# Altium project Copy of MB1363.PrjPcb (part 1 of 2)
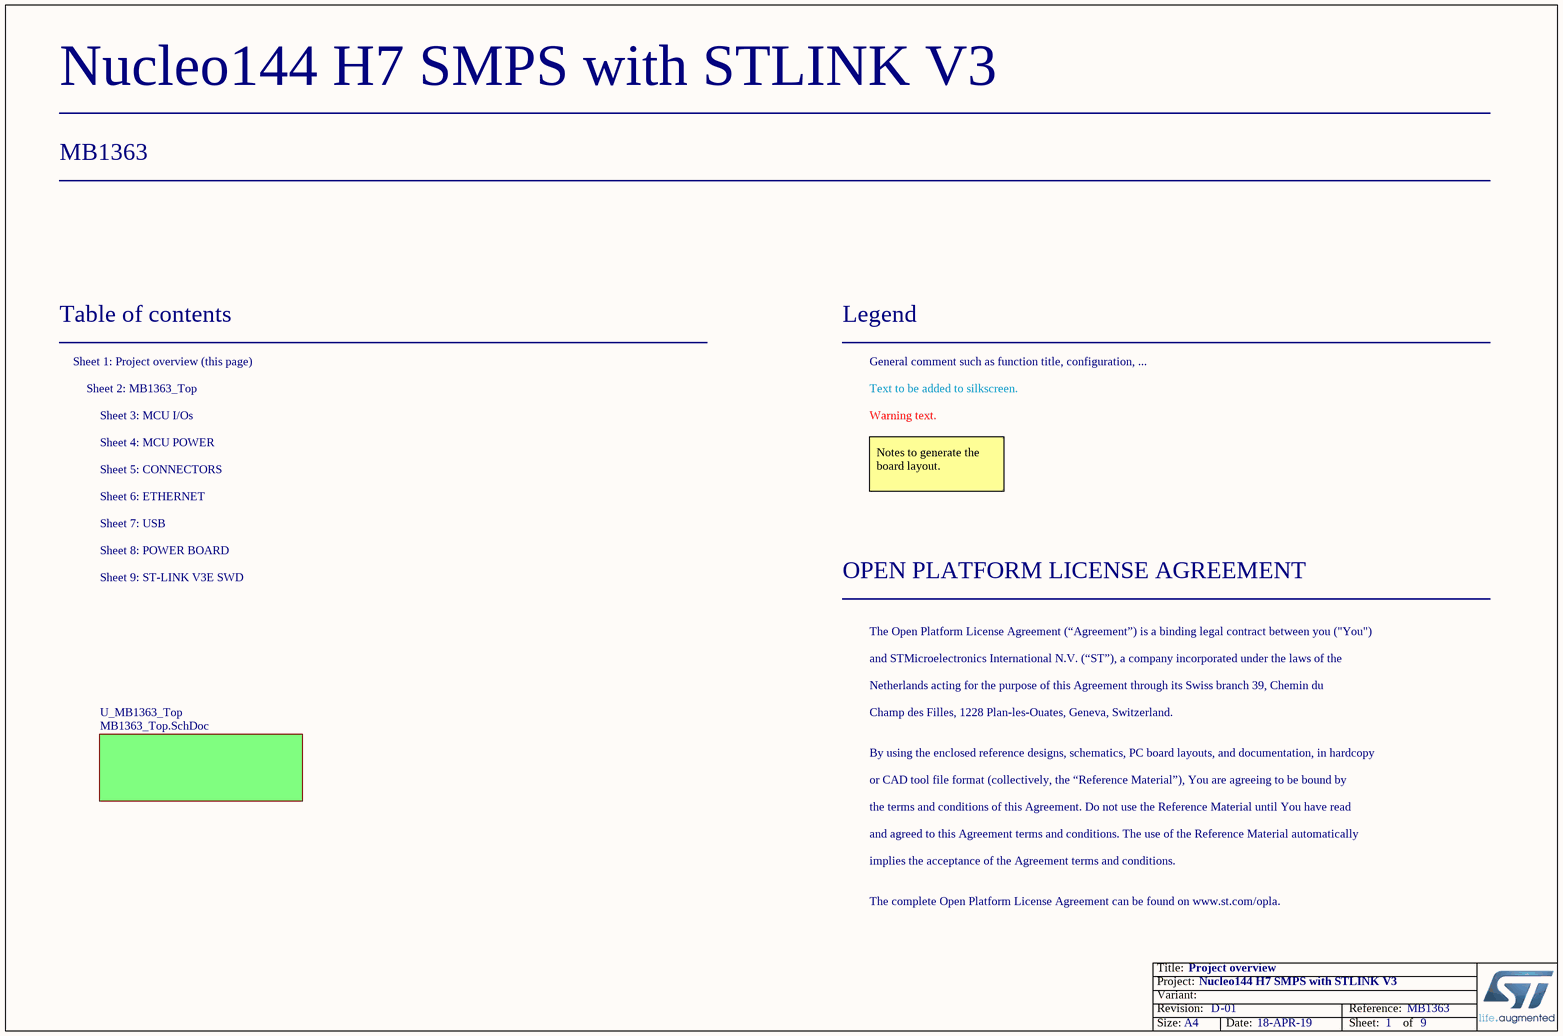
[diagram p0: Copy of Project_Overview.SchDoc]
Board_Assembly_Revision: 01; Board_Document_Date: 18-APR-19; Board_Name: Nucleo144 H7 SMPS with STLINK V3; Board_PCB_Revision: D; Board_Reference: MB1363
11 sheets, 237 parts. Net scope: hierarchical (ports join the sheet entries above them; power ports are global).
Board file: Copy of MB1363.PcbDoc
Sheets:
  Copy of Project_Overview.SchDoc
  Copy of mb1363_Top.SchDoc
    U_Connectors = Copy of Connectors.SchDoc
    U_Power_Board = Copy of Power_Board.SchDoc
    U_MCU_144_IOs = Copy of MCU_144_IOs.SchDoc
    U_MCU_144_POWER = Copy of MCU_144_POWER.SchDoc
    U_USB = USB.SchDoc
    U_Ethernet = Ethernet.SchDoc
    U_ST_LINK_V3E = Copy of ST_LINK_V3E.SchDoc
    U_CAN_TJA1050_Page1 = CAN_TJA1050_Page1.SchDoc
    U_12V_Regulator = 12V_Regulator.SchDoc

## Sheet Copy of Project_Overview.SchDoc: Project overview
size A4; Date: Not used; ApprovedBy: Not used; CheckedBy: Not used; Author: Not used; CompanyName: STMicroelectronics; DrawnBy: Not used; Engineer: Not used; Organization: Not used; Address1: Not used; Address2: Not used; Address3: Not used; Address4: Not used; DocumentNumber: 1; Revision: Not used; SheetNumber: 1; SheetTotal: 9; CurrentTime: Not used; CurrentDate: Not used; Time: Not used; DocumentFullPathAndName: Not used; DocumentName: Not used; ModifiedDate: Not used; ImagePath: Not used; ProjectName: Not used; Application_BuildNumber: Not used

### Sub-sheets
U_MB1363_Top = MB1363_Top.SchDoc (file not in this document): no entries

### Notes on the sheet
- Table of contents
- Sheet 1: Project overview (this page)
- Legend
- General comment such as function title, configuration, ...
- Sheet 2: MB1363_Top
- Sheet 4: MCU POWER
- Sheet 3: MCU I/Os
- Text to be added to silkscreen.
- Warning text.
- Sheet 6: ETHERNET
- Sheet 5: CONNECTORS
- Notes to generate the board layout.
- Sheet 9: ST-LINK V3E SWD
- Sheet 7: USB
- Sheet 8: POWER BOARD
- OPEN PLATFORM LICENSE AGREEMENT
- The Open Platform License Agreement (“Agreement”) is a binding legal contract between you ("You")
- and STMicroelectronics International N.V. (“ST”), a company incorporated under the laws of the
- Netherlands acting for the purpose of this Agreement through its Swiss branch 39, Chemin du
- Champ des Filles, 1228 Plan-les-Ouates, Geneva, Switzerland.
- By using the enclosed reference designs, schematics, PC board layouts, and documentation, in hardcopy
- or CAD tool file format (collectively, the “Reference Material”), You are agreeing to be bound by
- the terms and conditions of this Agreement. Do not use the Reference Material until You have read
- and agreed to this Agreement terms and conditions. The use of the Reference Material automatically
- implies the acceptance of the Agreement terms and conditions.
- The complete Open Platform License Agreement can be found on www.st.com/opla.
- Title:
- Project:
- Size:
- Revision:
- Variant:
- A4
- -
- Date:
- Reference:
- Sheet:
- of

## Sheet Copy of mb1363_Top.SchDoc: MB1363 Top: hierarchical view
size A4; Date: Not used; ApprovedBy: Not used; CheckedBy: Not used; Author: Not used; CompanyName: STMicroelectronics; DrawnBy: Not used; Engineer: Not used; Organization: Not used; Address1: Not used; Address2: Not used; Address3: Not used; Address4: Not used; DocumentNumber: 2; Revision: Not used; SheetNumber: 2; SheetTotal: 9; CurrentTime: Not used; CurrentDate: Not used; Time: Not used; DocumentFullPathAndName: Not used; DocumentName: Not used; ModifiedDate: Not used; ImagePath: Not used; ProjectName: Not used; Application_BuildNumber: Not used
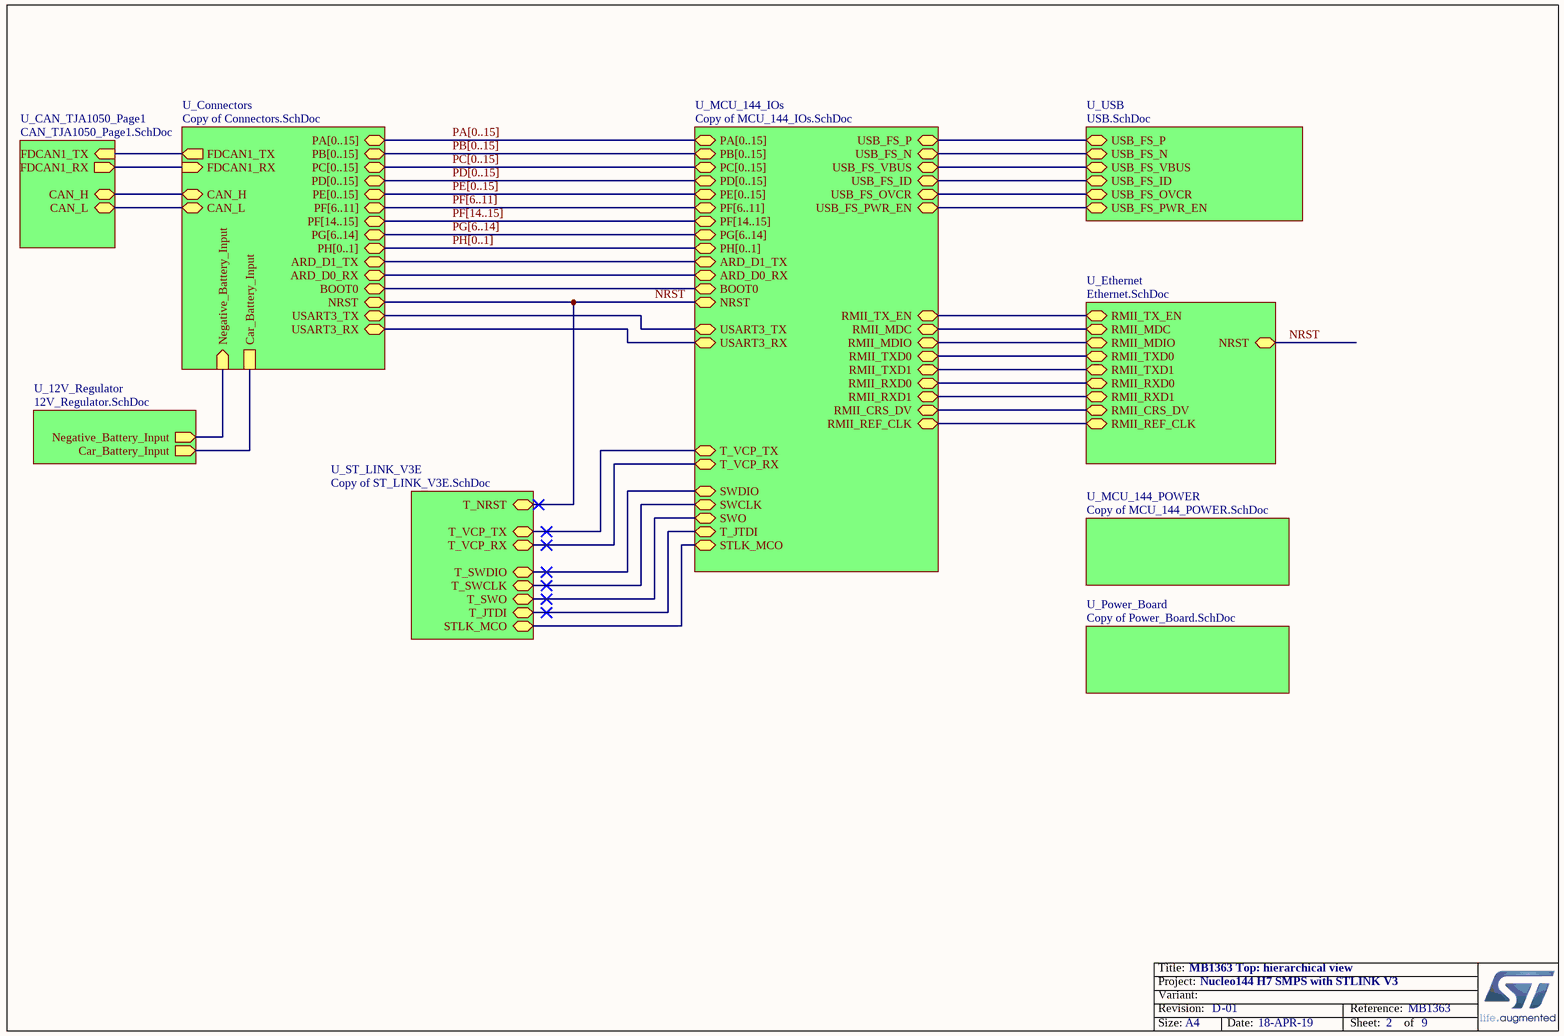
[diagram p1: Copy of mb1363_Top.SchDoc]

### Sub-sheets
U_12V_Regulator = 12V_Regulator.SchDoc: Car_Battery_Input (out), Negative_Battery_Input (out)
U_CAN_TJA1050_Page1 = CAN_TJA1050_Page1.SchDoc: CAN_L (bidir), CAN_H (bidir), FDCAN1_TX (in), FDCAN1_RX (out)
U_Connectors = Copy of Connectors.SchDoc: PA[0..15] (bidir), PB[0..15] (bidir), PC[0..15] (bidir), NRST (bidir), PD[0..15] (bidir), PE[0..15] (bidir), PF[6..11] (bidir), PG[6..14] (bidir), PH[0..1] (bidir), BOOT0 (bidir), PF[14..15] (bidir), ARD_D1_TX (bidir), ARD_D0_RX (bidir), FDCAN1_TX (out), FDCAN1_RX (in), Negative_Battery_Input (in), Car_Battery_Input, CAN_H (bidir), CAN_L (bidir), USART3_TX (bidir), USART3_RX (bidir)
U_Ethernet = Ethernet.SchDoc: RMII_CRS_DV (bidir), RMII_REF_CLK (bidir), RMII_TXD0 (bidir), RMII_RXD0 (bidir), RMII_TX_EN (bidir), NRST (bidir), RMII_RXD1 (bidir), RMII_MDC (bidir), RMII_TXD1 (bidir), RMII_MDIO (bidir)
U_MCU_144_IOs = Copy of MCU_144_IOs.SchDoc: NRST (bidir), BOOT0 (bidir), SWO (bidir), STLK_MCO (bidir), SWCLK (bidir), SWDIO (bidir), RMII_TX_EN (bidir), RMII_MDC (bidir), RMII_TXD0 (bidir), RMII_TXD1 (bidir), RMII_REF_CLK (bidir), RMII_RXD1 (bidir), RMII_MDIO (bidir), RMII_CRS_DV (bidir), RMII_RXD0 (bidir), USB_FS_N (bidir), USB_FS_P (bidir), USB_FS_OVCR (bidir), USB_FS_PWR_EN (bidir), USB_FS_VBUS (bidir), USB_FS_ID (bidir), T_VCP_TX (bidir), T_VCP_RX (bidir), PA[0..15] (bidir), PB[0..15] (bidir), PC[0..15] (bidir), PD[0..15] (bidir), PE[0..15] (bidir), PF[6..11] (bidir), PG[6..14] (bidir), PH[0..1] (bidir), PF[14..15] (bidir), ARD_D1_TX (bidir), ARD_D0_RX (bidir), T_JTDI (bidir), USART3_TX (bidir), USART3_RX (bidir)
U_MCU_144_POWER = Copy of MCU_144_POWER.SchDoc: no entries
U_Power_Board = Copy of Power_Board.SchDoc: no entries
U_ST_LINK_V3E = Copy of ST_LINK_V3E.SchDoc: T_NRST (bidir), STLK_MCO (bidir), T_SWDIO (bidir), T_VCP_TX (bidir), T_VCP_RX (bidir), T_SWCLK (bidir), T_SWO (bidir), T_JTDI (bidir)
U_USB = USB.SchDoc: USB_FS_N (bidir), USB_FS_P (bidir), USB_FS_OVCR (bidir), USB_FS_PWR_EN (bidir), USB_FS_VBUS (bidir), USB_FS_ID (bidir)

### Nets
ARD_D0_RX: sheet U_Connectors/ARD_D0_RX, sheet U_MCU_144_IOs/ARD_D0_RX
ARD_D1_TX: sheet U_Connectors/ARD_D1_TX, sheet U_MCU_144_IOs/ARD_D1_TX
BOOT0: sheet U_Connectors/BOOT0, sheet U_MCU_144_IOs/BOOT0
CANH: sheet U_Connectors/CAN_H, sheet U_CAN_TJA1050_Page1/CAN_H
CANL: sheet U_Connectors/CAN_L, sheet U_CAN_TJA1050_Page1/CAN_L
Car_Battery_Input: sheet U_Connectors/Car_Battery_Input, sheet U_12V_Regulator/Car_Battery_Input
Negative_Battery_Input: sheet U_Connectors/Negative_Battery_Input, sheet U_12V_Regulator/Negative_Battery_Input
NRST: sheet U_Connectors/NRST, sheet U_MCU_144_IOs/NRST, sheet U_Ethernet/NRST, sheet U_ST_LINK_V3E/T_NRST  [project net CPU_RST]
PA13: sheet U_MCU_144_IOs/SWDIO, sheet U_ST_LINK_V3E/T_SWDIO
PA14: sheet U_MCU_144_IOs/SWCLK, sheet U_ST_LINK_V3E/T_SWCLK
PA15: sheet U_MCU_144_IOs/T_JTDI, sheet U_ST_LINK_V3E/T_JTDI
PB10: sheet U_Connectors/USART3_TX, sheet U_MCU_144_IOs/USART3_TX
PB11: sheet U_Connectors/USART3_RX, sheet U_MCU_144_IOs/USART3_RX
PD0: sheet U_Connectors/FDCAN1_RX, sheet U_CAN_TJA1050_Page1/FDCAN1_RX
PD1: sheet U_Connectors/FDCAN1_TX, sheet U_CAN_TJA1050_Page1/FDCAN1_TX
RMII_CRS_DV: sheet U_MCU_144_IOs/RMII_CRS_DV, sheet U_Ethernet/RMII_CRS_DV
RMII_MDC: sheet U_MCU_144_IOs/RMII_MDC, sheet U_Ethernet/RMII_MDC
RMII_MDIO: sheet U_MCU_144_IOs/RMII_MDIO, sheet U_Ethernet/RMII_MDIO
RMII_REF_CLK: sheet U_MCU_144_IOs/RMII_REF_CLK, sheet U_Ethernet/RMII_REF_CLK
RMII_RXD0: sheet U_MCU_144_IOs/RMII_RXD0, sheet U_Ethernet/RMII_RXD0
RMII_RXD1: sheet U_MCU_144_IOs/RMII_RXD1, sheet U_Ethernet/RMII_RXD1
RMII_TX_EN: sheet U_MCU_144_IOs/RMII_TX_EN, sheet U_Ethernet/RMII_TX_EN
RMII_TXD0: sheet U_MCU_144_IOs/RMII_TXD0, sheet U_Ethernet/RMII_TXD0
RMII_TXD1: sheet U_MCU_144_IOs/RMII_TXD1, sheet U_Ethernet/RMII_TXD1
STLK_MCO: sheet U_MCU_144_IOs/STLK_MCO, sheet U_ST_LINK_V3E/STLK_MCO
T_SWO: sheet U_MCU_144_IOs/SWO, sheet U_ST_LINK_V3E/T_SWO
T_VCP_RX: sheet U_MCU_144_IOs/T_VCP_RX, sheet U_ST_LINK_V3E/T_VCP_RX
T_VCP_TX: sheet U_MCU_144_IOs/T_VCP_TX, sheet U_ST_LINK_V3E/T_VCP_TX
USB_FS_ID: sheet U_MCU_144_IOs/USB_FS_ID, sheet U_USB/USB_FS_ID
USB_FS_N: sheet U_MCU_144_IOs/USB_FS_N, sheet U_USB/USB_FS_N
USB_FS_OVCR: sheet U_MCU_144_IOs/USB_FS_OVCR, sheet U_USB/USB_FS_OVCR
USB_FS_P: sheet U_MCU_144_IOs/USB_FS_P, sheet U_USB/USB_FS_P
USB_FS_PWR_EN: sheet U_MCU_144_IOs/USB_FS_PWR_EN, sheet U_USB/USB_FS_PWR_EN
USB_FS_VBUS: sheet U_MCU_144_IOs/USB_FS_VBUS, sheet U_USB/USB_FS_VBUS

### Buses and harness runs
bus PA[0..15] = sheet U_Connectors/PA[0..15] = sheet U_MCU_144_IOs/PA[0..15]
bus PB[0..15] = sheet U_Connectors/PB[0..15] = sheet U_MCU_144_IOs/PB[0..15]
bus PC[0..15] = sheet U_Connectors/PC[0..15] = sheet U_MCU_144_IOs/PC[0..15]
bus PD[0..15] = sheet U_Connectors/PD[0..15] = sheet U_MCU_144_IOs/PD[0..15]
bus PE[0..15] = sheet U_Connectors/PE[0..15] = sheet U_MCU_144_IOs/PE[0..15]
bus PF[6..11] = sheet U_Connectors/PF[6..11] = sheet U_MCU_144_IOs/PF[6..11]
bus PF[14..15] = sheet U_Connectors/PF[14..15] = sheet U_MCU_144_IOs/PF[14..15]
bus PG[6..14] = sheet U_Connectors/PG[6..14] = sheet U_MCU_144_IOs/PG[6..14]
bus PH[0..1] = sheet U_Connectors/PH[0..1] = sheet U_MCU_144_IOs/PH[0..1]

### Notes on the sheet
- Title:
- Project:
- Size:
- Revision:
- Variant:
- A4
- -
- Date:
- Reference:
- Sheet:
- of

## Sheet Copy of Connectors.SchDoc: Connectors
size A3; Date: Not used; ApprovedBy: Not used; CheckedBy: Not used; Author: Not used; CompanyName: STMicroelectronics; DrawnBy: Not used; Engineer: Not used; Organization: Not used; Address1: Not used; Address2: Not used; Address3: Not used; Address4: Not used; DocumentNumber: 5; Revision: Not used; SheetNumber: 5; SheetTotal: 9; CurrentTime: Not used; CurrentDate: Not used; Time: Not used; DocumentFullPathAndName: Not used; DocumentName: Not used; ModifiedDate: Not used; ImagePath: Not used; ProjectName: Not used; Application_BuildNumber: Not used
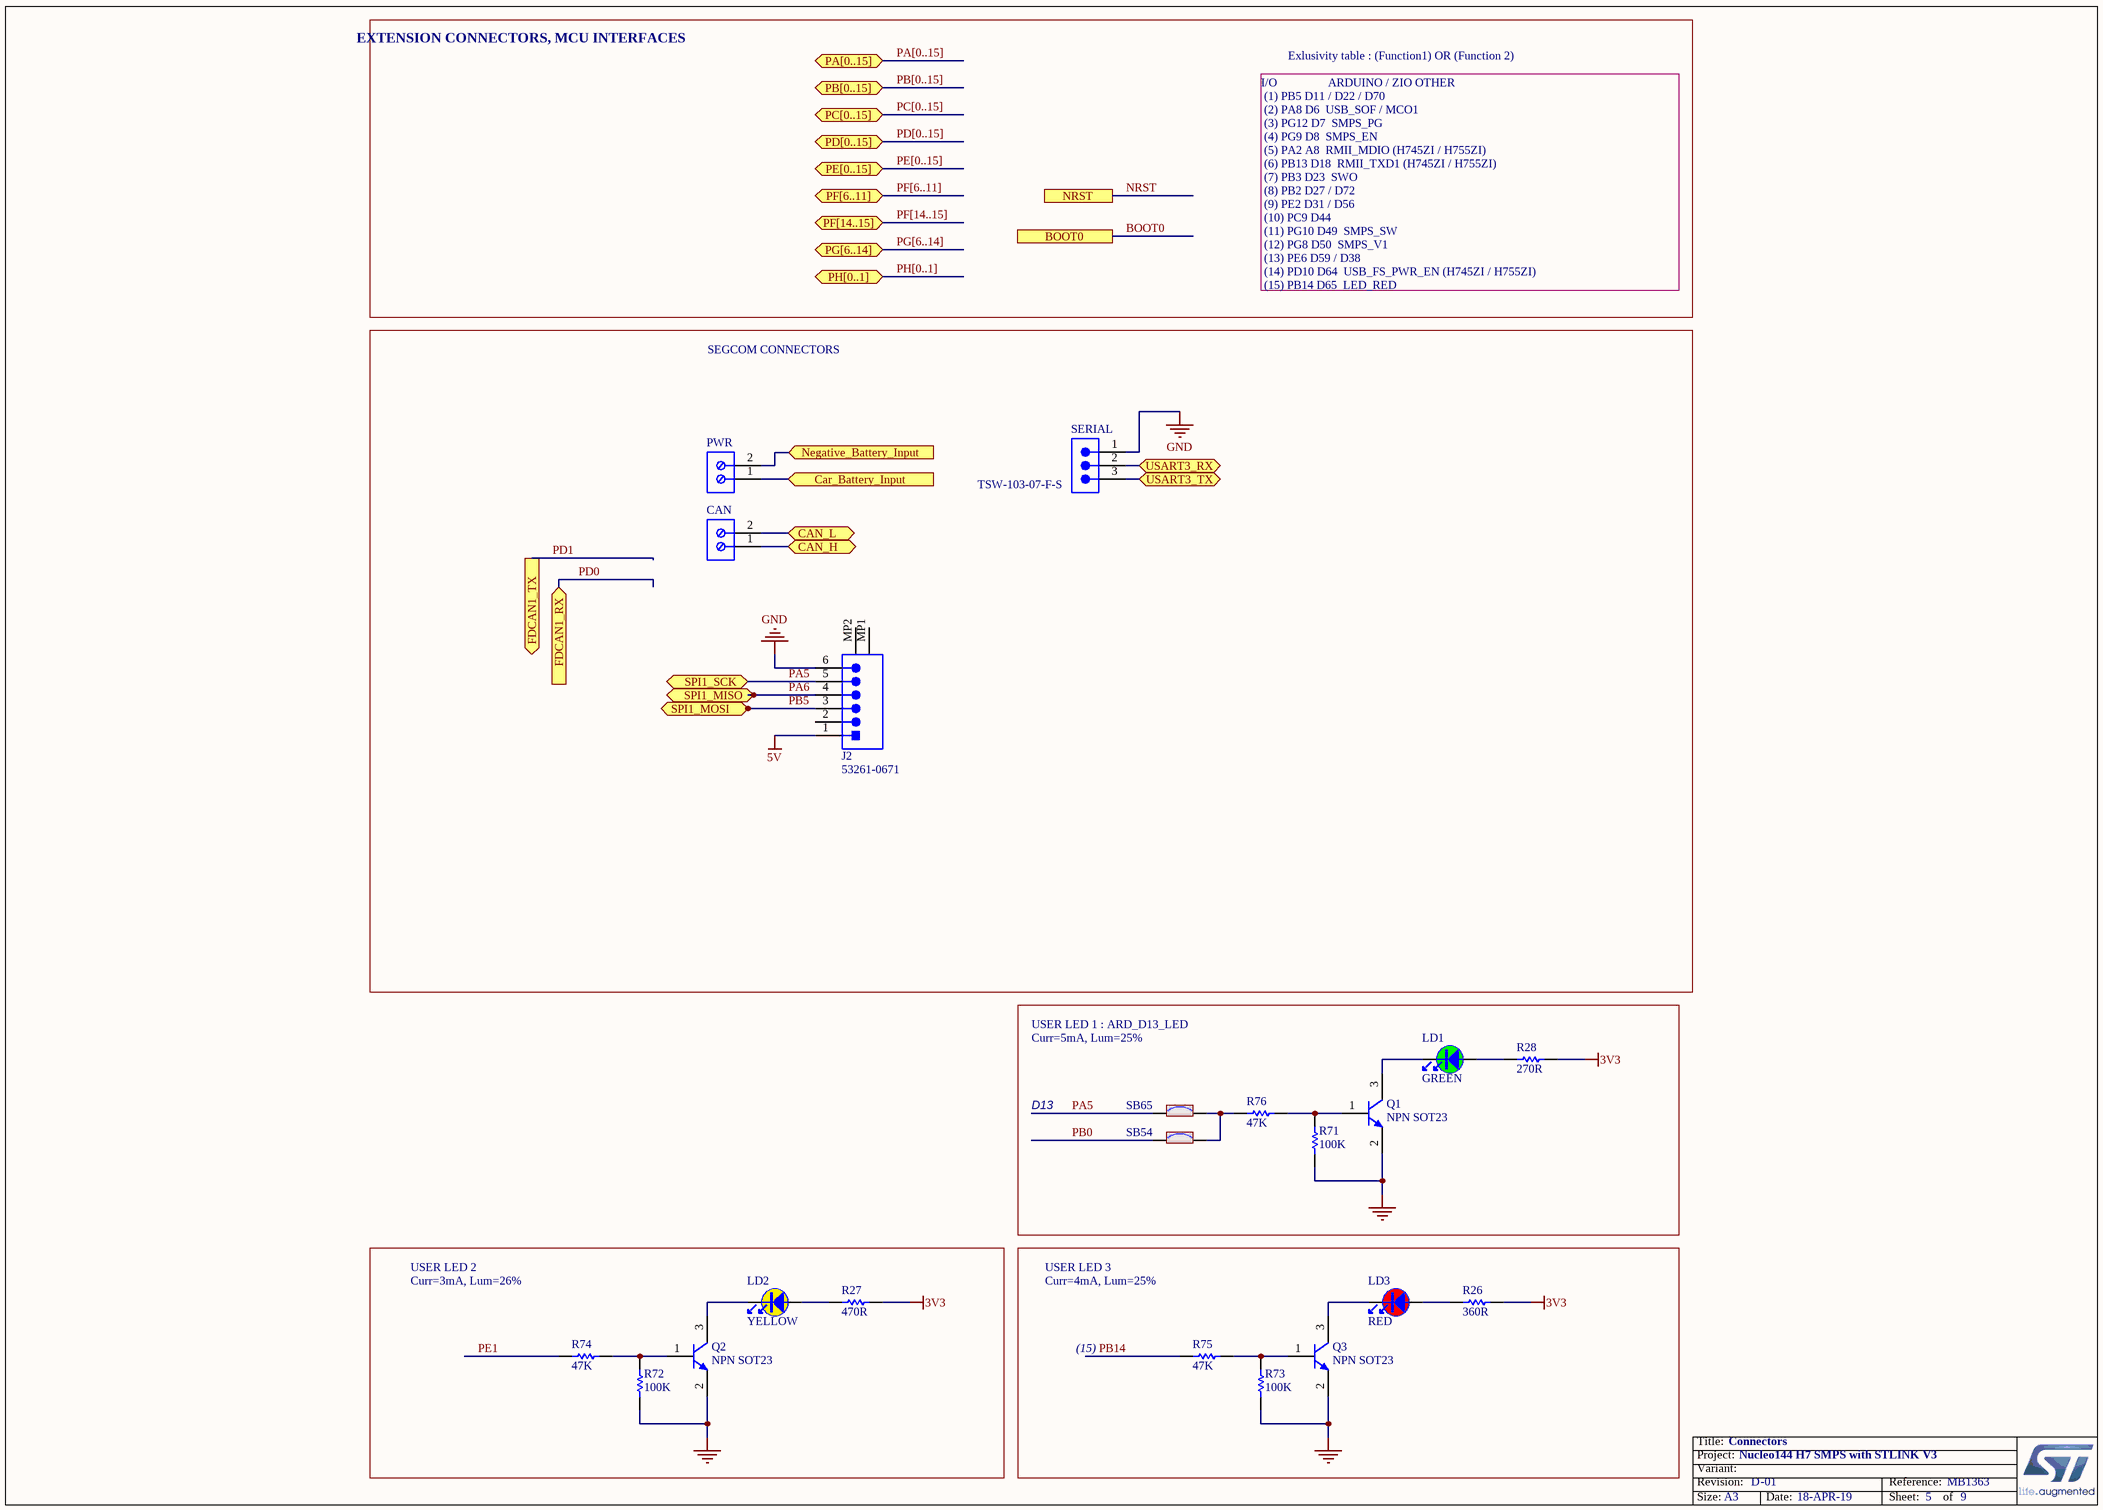
[diagram p2: Copy of Connectors.SchDoc]

### Parts
CAN  (no value)  [TECO-282836-2_V]
J2  53261-0671  [53261-0671]
LD1  value GREEN  [LED_0603_OSRAM_LG-Q396-PS-35_GREEN_1A2K_H0P4]  (hidden comment: LED_green)
LD2  value YELLOW  [LED_0603_OSRAM_LY-Q396-P1Q2-36_YELLOW_1A2K_H0P4]  (hidden comment: LED_yellow)
LD3  value RED  [LED_0603_OSRAM_LS-Q976-NR-1_RED_1A2K_H0P8]  (hidden comment: LED_red)
PWR  (no value)  [TECO-282836-2_V]
Q1  value NPN SOT23  [NPN_SOT23]  (hidden comment: 9013-SOT23)
Q2  value NPN SOT23  [NPN_SOT23]  (hidden comment: 9013-SOT23)
Q3  value NPN SOT23  [NPN_SOT23]  (hidden comment: 9013-SOT23)
R26  value 360R  [R0603]  (hidden comment: Resistor)
R27  value 470R  [R0603]  (hidden comment: Resistor)
R28  value 270R  [R0402]  (hidden comment: Resistor)
R71  value 100K  [R0603]  (hidden comment: Resistor)
R72  value 100K  [R0603]  (hidden comment: Resistor)
R73  value 100K  [R0603]  (hidden comment: Resistor)
R74  value 47K  [R0603]  (hidden comment: Resistor)
R75  value 47K  [R0603]  (hidden comment: Resistor)
R76  value 47K  [R0603]  (hidden comment: Resistor)
SB54  SB_ON  [SOLDER-BRIDGE_R0603-0R]  (value not drawn)
SB65  SB_ON  [SOLDER-BRIDGE_R0603-0R]  (value not drawn)
SERIAL  TSW-103-07-F-S  [SMTC-TSW-103-07-X-S]

### Blocks framed on the sheet
SEGCOM CONNECTORS: CAN J2 PWR SERIAL

### Ports
BOOT0, CAN_H (bidir), CAN_L (bidir), Car_Battery_Input (in), FDCAN1_RX (in), FDCAN1_TX (out), Negative_Battery_Input (in), NRST, PA[0..15] (bidir), PB[0..15] (bidir), PC[0..15] (bidir), PD[0..15] (bidir), PE[0..15] (bidir), PF[6..11] (bidir), PF[14..15] (bidir), PG[6..14] (bidir), PH[0..1] (bidir), SPI1_MISO (bidir), SPI1_MOSI (bidir), SPI1_SCK (bidir), USART3_RX (bidir), USART3_TX (bidir)

### Nets
3V3: R26.2 R27.2 R28.2
5V: J2.1
GND: J2.6 Q1.2(E) Q2.2(E) Q3.2(E) R71.1 R72.1 R73.1 SERIAL.1
CANH: CAN.1 ; port CAN_H
CANL: CAN.2 ; port CAN_L
Car_Battery_Input: PWR.1 ; port Car_Battery_Input
Negative_Battery_Input: PWR.2 ; port Negative_Battery_Input
PA5: J2.5 SB65.1 ; port SPI1_SCK
PA6: J2.4 ; port SPI1_MISO
PB0: SB54.1
PB5: J2.3 ; port SPI1_MOSI
PB10: SERIAL.3 ; port USART3_TX
PB11: SERIAL.2 ; port USART3_RX
PB14: R75.1
PE1: R74.1
NetLD1_1: LD1.1 R28.1
NetLD1_2: LD1.2 Q1.3(C)
NetLD2_1: LD2.1 R27.1
NetLD2_2: LD2.2 Q2.3(C)
NetLD3_1: LD3.1 R26.1
NetLD3_2: LD3.2 Q3.3(C)
NetQ1_1: Q1.1(B) R71.2 R76.2
NetQ2_1: Q2.1(B) R72.2 R74.2
NetQ3_1: Q3.1(B) R73.2 R75.2
NetR76_1: R76.1 SB54.2 SB65.2

Not connected (* = marked no-connect by the designer): J2 2 MP1 MP2

### Buses and harness runs
bus PA[0..15] = port PA[0..15]
bus PB[0..15] = port PB[0..15]
bus PC[0..15] = port PC[0..15]
bus PD[0..15] = port PD[0..15]
bus PE[0..15] = port PE[0..15]
bus PF[6..11] = port PF[6..11]
bus PF[14..15] = port PF[14..15]
bus PG[6..14] = port PG[6..14]
bus PH[0..1] = port PH[0..1]

### Notes on the sheet
- EXTENSION CONNECTORS, MCU INTERFACES
- Exlusivity table : (Function1) OR (Function 2)
- I/O	                ARDUINO / ZIO	OTHER
  (1)	PB5	D11 / D22 / D70
  (2)	PA8	D6		USB_SOF / MCO1
  (3)	PG12	D7		SMPS_PG
  (4)	PG9	D8		SMPS_EN
  (5)	PA2	A8		RMII_MDIO (H745ZI / H755ZI)
  (6)	PB13	D18		RMII_TXD1 (H745ZI / H755ZI)
  (7)	PB3	D23		SWO
  (8)	PB2	D27 / D72
  (9)	PE2	D31 / D56
  (10)	PC9	D44
  (11)	PG10	D49		SMPS_SW
  (12)	PG8	D50		SMPS_V1
  (13)	PE6	D59 / D38
  (14)	PD10	D64		USB_FS_PWR_EN (H745ZI / H755ZI)
  (15)	PB14	D65		LED_RED
- USER LED 1 : ARD_D13_LED
- Curr=5mA, Lum=25%
- D13
- USER LED 2
- Curr=3mA, Lum=26%
- USER LED 3
- Curr=4mA, Lum=25%
- (15)
- Title:
- Project:
- Size:
- Revision:
- Variant:
- A3
- -
- Date:
- Reference:
- Sheet:
- of

### Library data of the parts
CAN PWR = CMP-1684-00017-1: Female Header, Pitch 5 mm, 1 x 2 Position, Height 10 mm, Tail Length 3.5 mm, Rohs, Bulk; Manufacturer: TE Connectivity; Wire Gauge: 16-30AWG; Product Training Modules: Wire-to-BoardEurostyleTerminalBlocks; Clamp Material - Plating: Brass-NickelPlated; Voltage: 300V; Mating Orientation: HorizontalwithBoard; Current: 13.5A; Pitch: 0.197"(5.00mm); Screw Thread: M3; 3D Model: 282836-2.pdf; Other Names: 5ULV-02B / A98076; Dynamic Catalog: BuchananSeries; Number of Levels: 1; Torque - Screw: 0.68Nm(6Lb-In); Featured Product: EurostyleTerminalBlockConnectors; Positions Per Level: 2; Wire Termination: Screw-RisingCageClamp; Datasheet URL: http://www.te.com.cn/commerce/DocumentDelivery/DDEController?Action=showdoc&DocId=Catalog+Section%7F1308389_EUROSTYLE_TERMINAL_BLOCKS%7F0607%7Fpdf%7FEnglish%7FENG_CS_1308389_EUROSTYLE_TERMINAL_BLOCKS_0607.pdf%7F282836-2; Color: Green; Family: TerminalBlocks-WiretoBoard; RoHS Information: 282836-2StatementofCompliance; Standard Package: 300; Contact Material - Plating: Brass-TinPlated; Manufacturer URL: http://www.te.com; Housing Material: Polyamide(PA66),Nylon6/6; Features: Interlocking(Side); Package Description: Female Header, Pitch 5 mm, 1 x 2 Position, Height 10 mm, Tail Length 3.5 mm; Mounting Type: ThroughHole; Package Reference: THD; Packaging: Bulk; Series: Buchanan; Category: Connectors,Interconnects; Screw Material - Plating: Brass-NickelPlated
J2 = CMP-002-00079-1: 1.25mm (.049") Pitch PicoBlade Header, Surface Mount, Right Angle, Lead-free, 6 Circuits; Manufacturer Series: 53261; Manufacturer: Molex; Filter Feature: No; Number of Positions: 6; Voltage Rating (DC): 125V; Body Plating: Tin; Number of Rows Loaded: 1; Gender: Male; Glow Wire Compliant: Non-compliant; Insulation Resistance: 100MR; Current Rating: 1A; Option: General Purpose; ComponentLink6Description: https://datasheet.ciiva.com/9468/0532610671-pcb-headers-9468508.pdf?src-supplier=Avnet; Number of Circuits: 6; Termination: SMD/SMT; Source: Board.SCHLIB; Number of Contacts: 6; ComponentLink3URL: https://datasheet.ciiva.com/11746/0900766b8078fc7f-11746609.pdf?src-supplier=Rs; Pricing 1: 1=0,58, 10=0,502, 50=0,502, 100=0,467, 1000=0,437, 10000=0,375 (USD); RoHS: Yes; Lead Free: Lead Free; Max Operating Temperature: 85°C; Design Item ID: 53261-0671; ComponentLink7URL: https://datasheet.ciiva.com/14156/gh116861-116874-e-14156230.pdf?src-supplier=Distrelec; Reach SVHC Compliant: Unknown; ComponentLink5URL: https://datasheet.ciiva.com/34302/1302107-34302178.pdf?src-supplier=Jameco; Flammability Rating: UL94 V-0; Plating: Tin; Pitch: 1.25mm; Contact Material: Bronze,Brass,Tin; ComponentLink2Description: https://datasheet.ciiva.com/30206/347800532610671-pcb-headers-30206472.pdf?src-supplier=Onlinecomponents.com; Voltage Rating: 125V; Mixed Contacts: No; Working Voltage: 125V; ComponentLink4URL: https://datasheet.ciiva.com/22703/1839670-22703170.pdf?src-supplier=Element14; ComponentLink1URL: https://datasheet.ciiva.com/5153/0532610671-pcb-headers-170915-5153227.pdf?src-supplier=Mouser; Category: Headers and Wire Housings; ComponentLink5Description: https://datasheet.ciiva.com/34302/1302107-34302178.pdf?src-supplier=Jameco; Manufacturer Part Number: 53261-0671; Color: Beige; Voltage Rating (AC): 125V; Lead Pitch: 1.25mm; DIN Conformance: No; Number of Rows: 1; Package Quantity: 1000; ComponentLink7Description: https://datasheet.ciiva.com/14156/gh116861-116874-e-14156230.pdf?src-supplier=Distrelec; Series: PicoBlade; RoHS Compliant: Yes; Mounting Style: STRAIGHT; Contact Plating: Tin; Min Operating Temperature: -40°C; Orientation: Right Angle; Packaging: Tape and Reel; ComponentLink2URL: https://datasheet.ciiva.com/30206/347800532610671-pcb-headers-30206472.pdf?src-supplier=Onlinecomponents.com; Mounting Technology: Board; ComponentLink3Description: https://datasheet.ciiva.com/11746/0900766b8078fc7f-11746609.pdf?src-supplier=Rs; ComponentLink4Description: https://datasheet.ciiva.com/22703/1839670-22703170.pdf?src-supplier=Element14; Stock 1: 44828; Contact Gender: Male; ComponentLink6URL: https://datasheet.ciiva.com/9468/0532610671-pcb-headers-9468508.pdf?src-supplier=Avnet; IEC Conformance: No; ComponentLink1Description: https://datasheet.ciiva.com/5153/0532610671-pcb-headers-170915-5153227.pdf?src-supplier=Mouser; Housing Material: Thermoplastic; Radiation Hardening: No; MIL Conformance: No
LD1 = MCD-00588: LED Green, 0603 SMD, Forward Voltage Typ=2V, Max=2.5V; Part_Type: Display; Manufacturer_Part_Number: LG Q396-PS-35; Manufacturer: OSRAM OPTO SEMICONDUCTORS; Alternate_Manufacturer_Part_Number: VLMTG1300-GS08; Alternate_Manufacturer: VISHAY SEMICONDUCTOR OPTO DIVISION; Provided_By: SUBCO; Internal_Part_Number: MCD-00588; Status: Released; Package: LED 0603; ComponentLink1Description: Datasheet; ComponentLink1URL: http://tunmcdsvn.tun.st.com/Component_Datasheet_Library/Trunk/Display/OSRAM_LED_GREEN_LG Q396-PS-35; Order_Code_Digikey: LG Q396-PS-35-ND; ECCN_US: n/a; ECCN_EU: n/a
LD2 = MCD-01061: LED Yellow, 0603 SMD, Forward Voltage min=1.7V, Typ=2V, Max=2.3V; Part_Type: Display; Manufacturer_Part_Number: LY Q396-P1Q2-36; Manufacturer: OSRAM OPTO SEMICONDUCTORS; Provided_By: SUBCO; Internal_Part_Number: MCD-01061; Status: Released; ComponentLink1Description: Datasheet; ComponentLink1URL: http://tunmcdsvn.tun.st.com/Component_Datasheet_Library/Trunk/Display/OSRAM_LED_0603_YELLOW_LY Q396-P1Q2-36; ECCN_US: n/a; ECCN_EU: n/a
LD3 = MCD-00586: LED Red, 0603 SMD, Forward Voltage Typ=2V, Max=2.5V; Part_Type: Display; Manufacturer_Part_Number: LS Q976-NR-1; Manufacturer: OSRAM OPTO SEMICONDUCTORS; Alternate_Manufacturer_Part_Number: VLMS1300-GS08; Alternate_Manufacturer: VISHAY SEMICONDUCTOR OPTO DIVISION; Provided_By: SUBCO; Internal_Part_Number: MCD-00586; Status: Released; Package: LED 0603; ComponentLink1Description: Datasheet; ComponentLink1URL: http://tunmcdsvn.tun.st.com/Component_Datasheet_Library/Trunk/Display/OSRAM_LED_RED_LS Q976-NR-1; Order_Code_Digikey: 475-2512-1-ND; ECCN_US: n/a; ECCN_EU: n/a
Q1-Q3 = MCD-00073: NPN Bipolar Transistor; Part_Type: IC; Manufacturer_Part_Number: BSR14; Manufacturer: ON SEMICONDUCTOR; Alternate_Manufacturer_Part_Number: MMBT2222LT1G / MMBT2222ALT1G / MMBT2222ALT3G; Provided_By: SUBCO; ECCN_US: EAR99; ECCN_EU: NEC; Revision: *; Internal_Part_Number: MCD-00073; Status: Released; ComponentLink1Description: Datasheet; ComponentLink1URL: http://tunmcdsvn.tun.st.com/Component_Datasheet_Library/Trunk/IC/NXP_Transistor_BSR14; Alternate_Manufacturer: ON SEMICONDUCTOR; Package: SOT23
R26 = MCD-00462: Resistor,360R,0603,1%,1/10W; Manufacturer_Part_Number: RC0603FR-07360RL; Manufacturer: YAGEO; BMS_Part_Number: 9129744; Provided_By: SUBCO; ECCN_US: EAR99; ECCN_EU: NEC; Internal_Part_Number: MCD-00462; Status: Released; Part_Type: Resistor; Package: R0603; ComponentLink1Description: Datasheet; ComponentLink1URL: http://tunmcdsvn.tun.st.com/Component_Datasheet_Library/Trunk/Resistors/Yageo_Resistor_RC0603-series
R27 = MCD-00354: Resistor,470R,0603,1%,1/10W; Manufacturer_Part_Number: RC0603FR-07470RL; Manufacturer: YAGEO; BMS_Part_Number: 9129906; Provided_By: SUBCO; ECCN_US: EAR99; ECCN_EU: NEC; Internal_Part_Number: MCD-00354; Status: Released; Part_Type: Resistor; Package: R0603; ComponentLink1Description: Datasheet; ComponentLink1URL: http://tunmcdsvn.tun.st.com/Component_Datasheet_Library/Trunk/Resistors/Yageo_Resistor_RC0603-series
R28 = MCD-00441: Resistor,270R,0402,1%,1/16W; Manufacturer_Part_Number: RC0402FR-07270RL; Manufacturer: YAGEO; Provided_By: SUBCO; ECCN_US: EAR99; ECCN_EU: NEC; Internal_Part_Number: MCD-00441; Status: Released; Part_Type: Resistor; Package: R0402; ComponentLink1Description: Datasheet; ComponentLink1URL: http://tunmcdsvn.tun.st.com/Component_Datasheet_Library/Trunk/Resistors/Yageo_Resistor_RC0402-series
R71-R73 = MCD-00223: Resistor,100K,0603,1%,1/10W; Manufacturer_Part_Number: RC0603FR-07100KL; Manufacturer: YAGEO; Provided_By: SUBCO; ECCN_US: EAR99; ECCN_EU: NEC; Internal_Part_Number: MCD-00223; Status: Released; Part_Type: Resistor; ComponentLink1Description: Datasheet; Package: R0603; ComponentLink1URL: http://tunmcdsvn.tun.st.com/Component_Datasheet_Library/Trunk/Resistors/Yageo_Resistor_RC0603-series
R74-R76 = MCD-00222: Resistor,47K,0603,1%,1/10W; Manufacturer_Part_Number: RC0603FR-0747KL; Manufacturer: YAGEO; Provided_By: SUBCO; ECCN_US: EAR99; ECCN_EU: NEC; Internal_Part_Number: MCD-00222; Status: Released; Part_Type: Resistor; ComponentLink1Description: Datasheet; Package: R0603; ComponentLink1URL: http://tunmcdsvn.tun.st.com/Component_Datasheet_Library/Trunk/Resistors/Yageo_Resistor_RC0603-series
SB54 SB65 = MCD-00071: Solder Bridge ON; Part_Type: Mechanical; Manufacturer_Part_Number: RC0603JR-070RL; Manufacturer: YAGEO; Provided_By: SUBCO; Internal_Part_Number: MCD-00071; Status: Released; ComponentLink1Description: Datasheet; Package: SB0603; ComponentLink1URL: http://tunmcdsvn.tun.st.com/Component_Datasheet_Library/Trunk/Resistors/Yageo_Resistor_RC0603-series; ECCN_US: n/a; ECCN_EU: n/a
SERIAL = CMP-1024-00331-1: 0.025" SQ Post Header, Through-hole, Vertical, -55 to 125 degC, 2.54 mm Pitch, 3-Pin, Male, RoHS; Manufacturer: Samtec; Pitch: 2.54 mm; DatasheetVersion: F-214; ComponentLink1Description: Manufacturer URL; ComponentLink3URL: http://www.samtec.com/documents/webfiles/cpdf/TSW-XXX-XX-XXX-X-XX-XXX-MKT.pdf; Mounting Technology: Through-hole; PackageDescription: .025[0.64] SQ. Post Terminal Strip Assembly; Temperature Range: -55 to 125 degC; ComponentLink3Description: Package Specification; Orientation: Vertical; PartNumber: TSW-103-07-F-S; RoHS: True; PackageVersion: DM, 8/1988; ComponentLink2Description: Datasheet; ComponentLink1URL: http://www.samtec.com; ComponentLink2URL: http://www.samtec.com/documents/webfiles/pdf/TSW_TH.PDF; PackageReference: TSW-103-07-X-S

## Sheet Copy of Power_Board.SchDoc: MAIN POWER 5V / 3V3 / 1V8
size A4; Date: Not used; ApprovedBy: Not used; CheckedBy: Not used; Author: Not used; CompanyName: STMicroelectronics; DrawnBy: Not used; Engineer: Not used; Organization: Not used; Address1: Not used; Address2: Not used; Address3: Not used; Address4: Not used; DocumentNumber: 9; Revision: Not used; SheetNumber: 8; SheetTotal: 9; CurrentTime: Not used; CurrentDate: Not used; Time: Not used; DocumentFullPathAndName: Not used; DocumentName: Not used; ModifiedDate: Not used; ImagePath: Not used; ProjectName: Not used; Application_BuildNumber: Not used
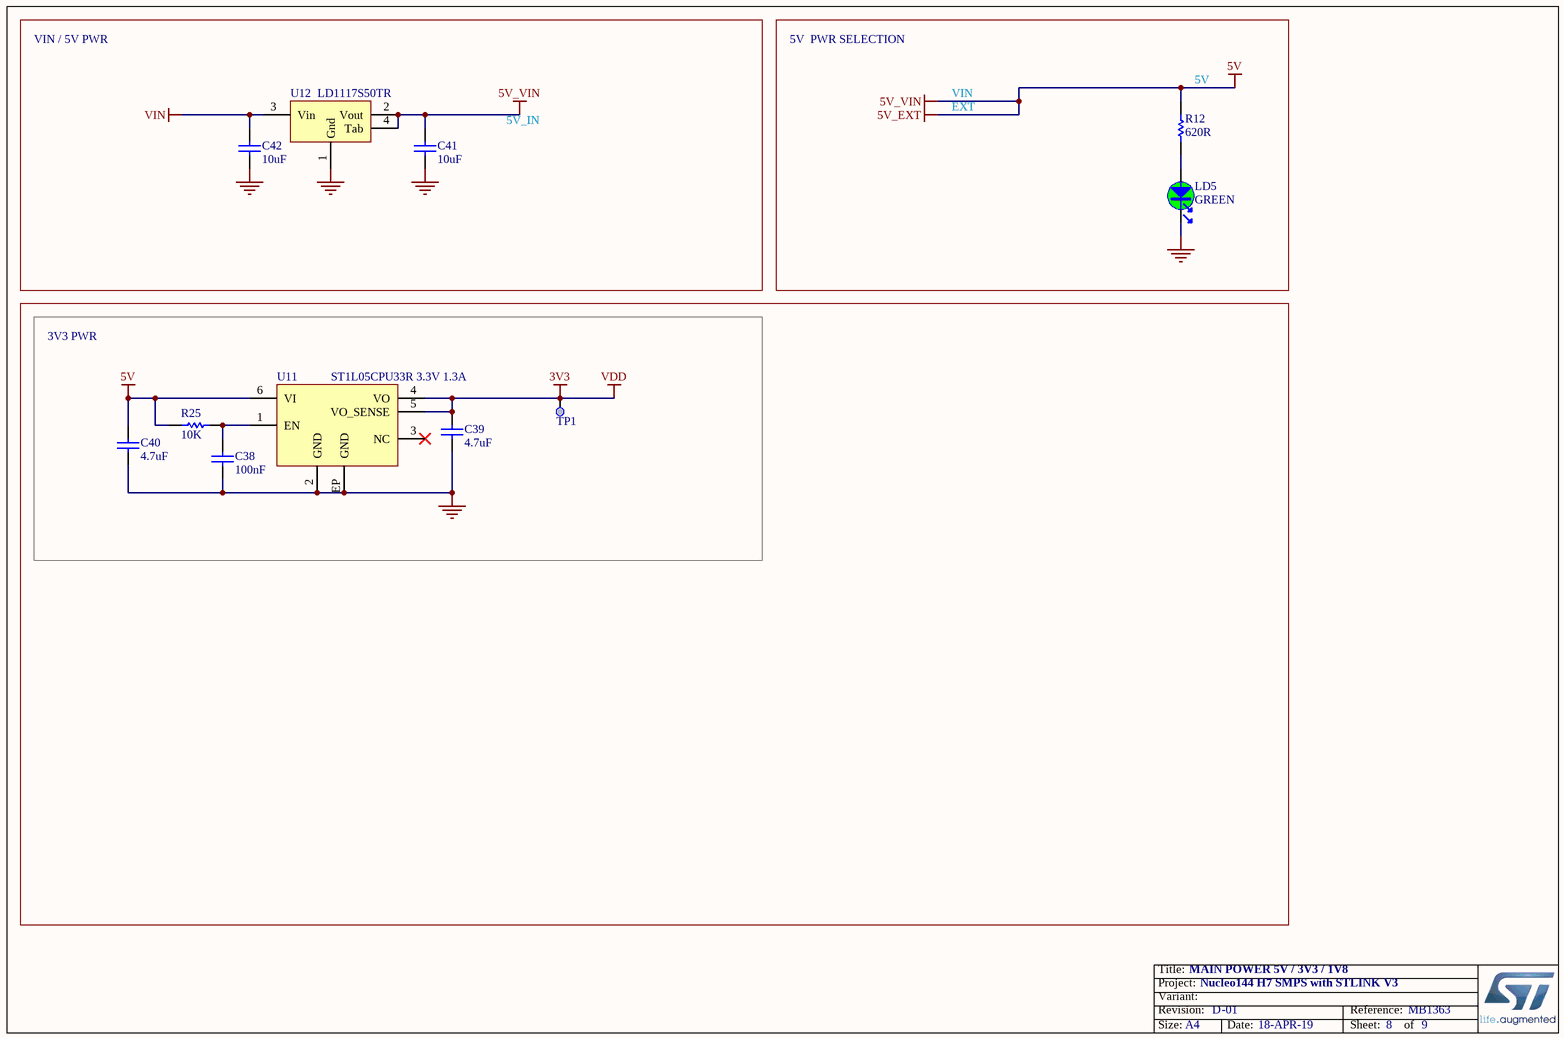
[diagram p3: Copy of Power_Board.SchDoc]

### Parts
C38  value 100nF  [C0402]  (hidden comment: Capacitor)
C39  value 4.7uF  [C0603]  (hidden comment: Capacitor)
C40  value 4.7uF  [C0603]  (hidden comment: Capacitor)
C41  value 10uF  [C0805]  (hidden comment: Capacitor)
C42  value 10uF  [C0805]  (hidden comment: Capacitor)
LD5  value GREEN  [LED_0603_OSRAM_LG-Q396-PS-35_GREEN_1A2K_H0P4]  (hidden comment: LED_green)
R12  value 620R  [R0603]  (hidden comment: Resistor)
R25  value 10K  [R0402]  (hidden comment: Resistor)
TP1  Test Point  [TP_SMD_1MM]  (value not drawn)  (no BOM)
U11  value ST1L05CPU33R 3.3V 1.3A  [ICC_DFN6-EPAD_3X3_P095]  (hidden comment: ST1L05CPU33R)
U12  LD1117S50TR  [REG_SOT223-TAB]

### Blocks framed on the sheet
3V3 PWR: C38-C40 R25 TP1 U11

### Nets
3V3: C39.2 TP1.1 U11.4(VO) U11.5(VO_SENSE)  [also labelled VDD]
5V: C40.2 C41.2 R12.2 R25.2 U11.6(VI) U12.2(Vout) U12.4(Tab)  [also labelled 5V_EXT, 5V_VIN]
GND: C38.2 C39.1 C40.1 C41.1 C42.1 LD5.2 U11.2(GND) U11.EP(GND) U12.1(Gnd)
VIN: C42.2 U12.3(Vin)
NetC38_1: C38.1 R25.1 U11.1(EN)
NetLD5_1: LD5.1 R12.1

Not connected (* = marked no-connect by the designer): U11 3(NC)*

### Notes on the sheet
- VIN / 5V PWR
- 5V  PWR SELECTION
- VIN
- EXT
- (near R12) 5V
- 5V_IN
- Title:
- Project:
- Size:
- Revision:
- Variant:
- A4
- -
- Date:
- Reference:
- Sheet:
- of

### Library data of the parts
C38 = MCD-00006: Capacitor, MLCC, 100nF, 16V, X7R, 10%, 0402, T=0.5mm; Manufacturer_Part_Number: CC0402KRX7R7BB104; Manufacturer: YAGEO; Alternate_Manufacturer_Part_Number: GCM155R71C104KA55D; Alternate_Manufacturer: MURATA; Provided_By: SUBCO; ECCN_US: EAR99; ECCN_EU: NEC; Internal_Part_Number: MCD-00006; ComponentLink1Description: Datasheet; Status: Released; Package: C0402; Part_Type: Capacitor; ComponentLink1URL: http://tunmcdsvn.tun.st.com/Component_Datasheet_Library/Trunk/Capacitors/Yageo_Multilayer_Capacitor_X7R_series_100pF_to_22uF
C39 = MCD-01121: Capacitor, MLCC, 4.7µF, 10V, X5R, 20%, 0603, T=0,8mm; Manufacturer_Part_Number: GRM188R61A475ME15; Manufacturer: MURATA; Provided_By: SUBCO; ECCN_US: EAR99; ECCN_EU: NEC; Internal_Part_Number: MCD-01121; Status: Released; Part_Type: Capacitor; Package: C0603; ComponentLink1Description: Datasheet; ComponentLink1URL: http://tunmcdsvn.tun.st.com/Component_Datasheet_Library/Trunk/Capacitors/Murata_Capacitor_GR_series
C40 = MCD-00097: Capacitor, MLCC, 4.7uF, 16V, X5R, 20%, 0603, T=0,8mm; Manufacturer_Part_Number: GRM188R61C475KE11; Manufacturer: MURATA; Alternate_Manufacturer_Part_Number: GRM188R61C475MAAJ; Provided_By: SUBCO; ECCN_US: EAR99; ECCN_EU: NEC; Internal_Part_Number: MCD-00097; Status: Released; Part_Type: Capacitor; Package: C0603; ComponentLink1Description: Datasheet; ComponentLink1URL: http://tunmcdsvn.tun.st.com/Component_Datasheet_Library/Trunk/Capacitors/Murata_Capacitor_GR_series; Alternate_Manufacturer: Murata
C41 C42 = MCD-00014: Capacitor, MLCC, 10uF, 25V, X5R, 10%, 0805, T=0,85mm; Manufacturer_Part_Number: CC0805KRX5R8BB106; Manufacturer: YAGEO; Provided_By: SUBCO; ECCN_US: EAR99; ECCN_EU: NEC; Internal_Part_Number: MCD-00014; ComponentLink1Description: Datasheet; Status: Released; Part_Type: Capacitor; Package: C0805; ComponentLink1URL: http://tunmcdsvn.tun.st.com/Component_Datasheet_Library/Trunk/Capacitors/Yageo_Multilayer_capacitor_X5R_series_100pF_to_100uF
LD5 = MCD-00588: as LD1 on sheet Copy of Connectors; Internal_Part_Number: MCD-00588; Status: Released; Package: LED 0603; ComponentLink1Description: Datasheet; ComponentLink1URL: http://tunmcdsvn.tun.st.com/Component_Datasheet_Library/Trunk/Display/OSRAM_LED_GREEN_LG Q396-PS-35; Order_Code_Digikey: LG Q396-PS-35-ND; ECCN_US: n/a; ECCN_EU: n/a
R12 = MCD-00500: Resistor,620R,0603,1%,1/10W; Manufacturer_Part_Number: RC0603FR-07620RL; Manufacturer: YAGEO; Provided_By: SUBCO; ECCN_US: EAR99; ECCN_EU: NEC; Internal_Part_Number: MCD-00500; Status: Released; Part_Type: Resistor; Package: R0603; ComponentLink1Description: Datasheet; ComponentLink1URL: http://tunmcdsvn.tun.st.com/Component_Datasheet_Library/Trunk/Resistors/Yageo_Resistor_RC0603-series
R25 = MCD-00053: Resistor,10K,0402,1%,1/16W; Manufacturer_Part_Number: RC0402FR-0710KL; Manufacturer: YAGEO; Provided_By: SUBCO; ECCN_US: EAR99; ECCN_EU: NEC; Internal_Part_Number: MCD-00053; Status: Released; ComponentLink1Description: Datasheet; Part_Type: Resistor; Package: R0402; ComponentLink1URL: http://tunmcdsvn.tun.st.com/Component_Datasheet_Library/Trunk/Resistors/Yageo_Resistor_RC0402-series
TP1 = MCD-00074: Test Point 1mm; Part_Type: Mechanical; Internal_Part_Number: MCD-00074; Provided_By: n/a; Status: Released; ComponentLink1Description: Datasheet; ComponentLink1URL: http://na; Manufacturer: n/a; Manufacturer_Part_Number: n/a; ECCN_US: n/a; ECCN_EU: n/a
U11 = MCD-01025: LDO, 3.3V, 1.3A, Very low quiescent current BiCMOS voltage regulator; Part_Type: IC; Manufacturer: STMICROELECTRONICS; BMS_Part_Number: 9176246; Provided_By: SUBCO with ST control; ECCN_US: EAR99; ECCN_EU: NEC; Internal_Part_Number: MCD-01025; Status: Released; Manufacturer_Part_Number: ST1L05CPU33R; Package: DFN6-3x3; ComponentLink1Description: Datasheet; ComponentLink1URL: http://tunmcdsvn.tun.st.com/Component_Datasheet_Library/Trunk/IC/STM_LDO_ST1L05CPU33R
U12 = MCD-00088: IC REG LDO 5V 0.8A SOT223; Manufacturer: STMICROELECTRONICS; BMS_Part_Number: 9176133; Provided_By: SUBCO with ST control; ECCN_US: EAR99; ECCN_EU: NEC; Value: LD1117S50TR; Internal_Part_Number: MCD-00088; Manufacturer_Part_Number: LD1117S50TR; ComponentLink1Description: Datasheet; Status: Released; Part_Type: IC; ComponentLink1URL: http://tunmcdsvn.tun.st.com/Component_Datasheet_Library/Trunk/IC/STM_LDO_LD1117; Package: SOT-223

## Sheet Copy of MCU_144_IOs.SchDoc: MCU 144 I/Os
size A4; Date: Not used; ApprovedBy: Not used; CheckedBy: Not used; Author: Not used; CompanyName: STMicroelectronics; DrawnBy: Not used; Engineer: Not used; Organization: Not used; Address1: Not used; Address2: Not used; Address3: Not used; Address4: Not used; DocumentNumber: 3; Revision: Not used; SheetNumber: 3; SheetTotal: 9; CurrentTime: Not used; CurrentDate: Not used; Time: Not used; DocumentFullPathAndName: Not used; DocumentName: Not used; ModifiedDate: Not used; ImagePath: Not used; ProjectName: Not used; Application_BuildNumber: Not used
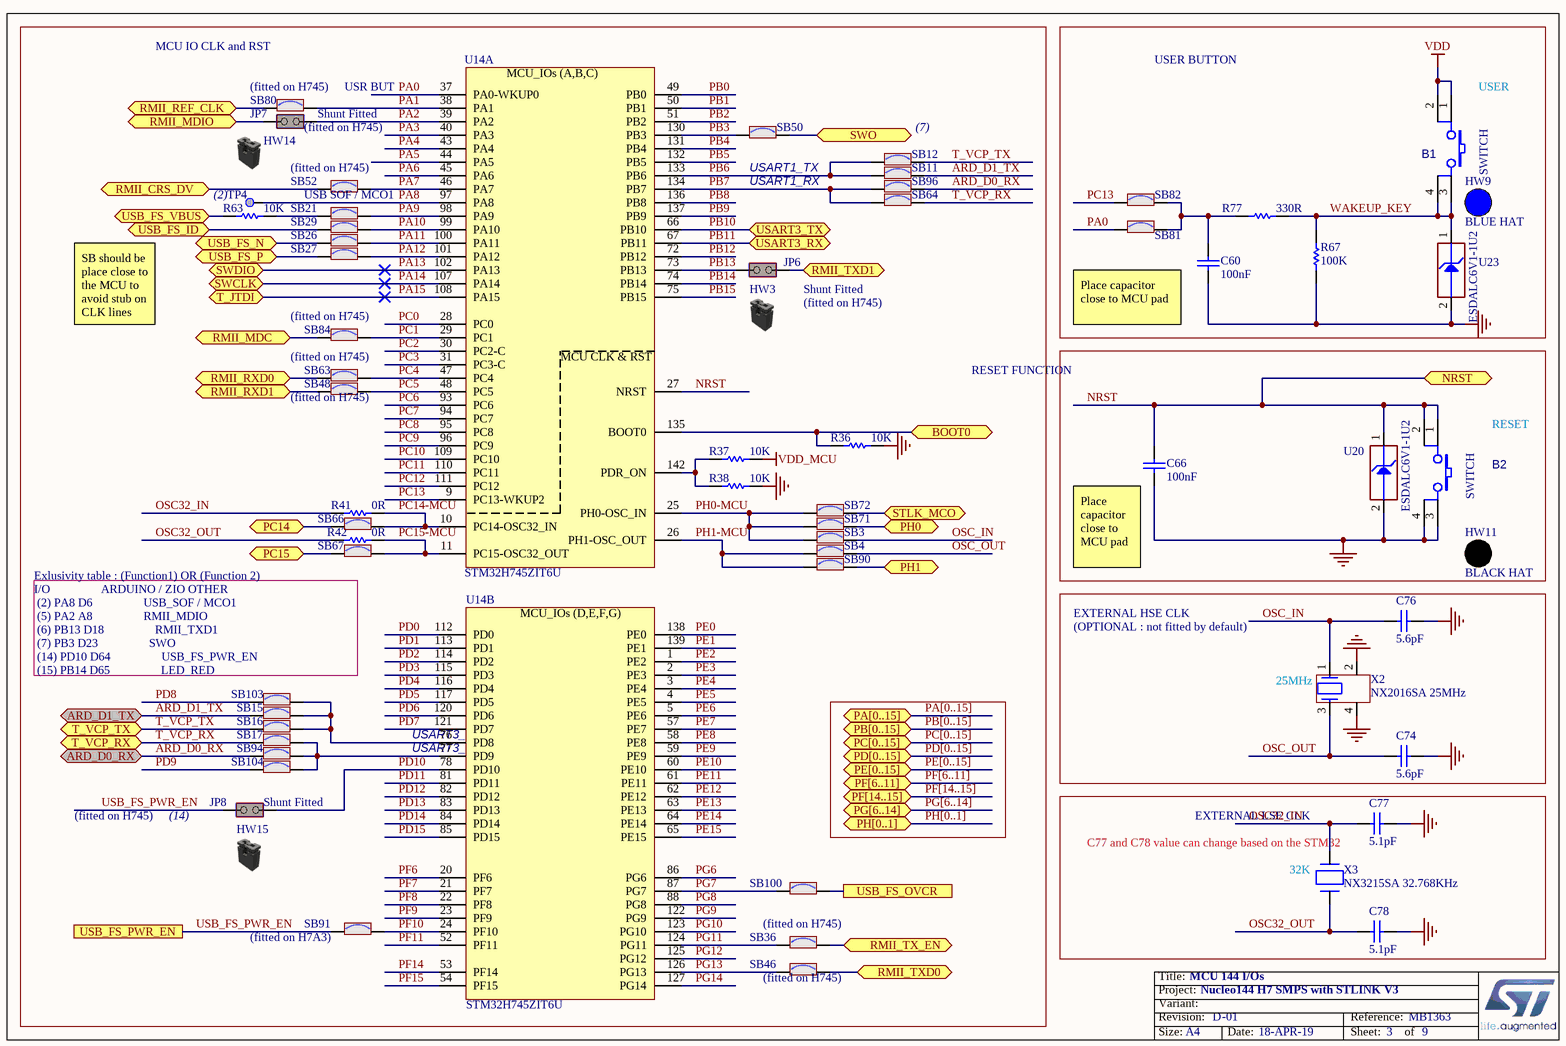
[diagram p4: Copy of MCU_144_IOs.SchDoc]

### Parts
B1  value SWITCH  [SWI_WEALTHMETAL_TD-0341_4P_BLUE]  (hidden comment: SW-PUSH-CMS)
B2  value SWITCH  [SWI_WEALTHMETAL_TD-0341_4P_BLACK]  (hidden comment: SW-PUSH-CMS)
C60  value 100nF  [C0603]  (hidden comment: Capacitor)
C66  value 100nF  [C0603]  (hidden comment: Capacitor)
C74  value 5.6pF  [C0402]  (hidden comment: Capacitor)
C76  value 5.6pF  [C0402]  (hidden comment: Capacitor)
C77  value 5.1pF  [C0603]  (hidden comment: Capacitor)
C78  value 5.1pF  [C0603]  (hidden comment: Capacitor)
HW3  Shunt Black 2.54mm  (value not drawn)  (mechanical)
HW9  value BLUE HAT  (hidden comment: BUTTON_HAT_BLUE)  (mechanical)
HW11  value BLACK HAT  (hidden comment: BUTTON_HAT_BLACK)  (mechanical)
HW14  Shunt Black 2.54mm  (value not drawn)  (mechanical)
HW15  Shunt Black 2.54mm  (value not drawn)  (mechanical)
JP6  value Shunt Fitted  [CON_SAMTEC_TSW-102-07-G-S]  (hidden comment: Jumper_Header 2x1 Fitted)
JP7  value Shunt Fitted  [CON_SAMTEC_TSW-102-07-G-S]  (hidden comment: Jumper_Header 2x1 Fitted)
JP8  value Shunt Fitted  [CON_SAMTEC_TSW-102-07-G-S]  (hidden comment: Jumper_Header 2x1 Fitted)
R36  value 10K  [R0603]  (hidden comment: Resistor)
R37  value 10K  [R0603]  (hidden comment: Resistor)
R38  value 10K  [R0603]  (hidden comment: Resistor)
R41  value 0R  [R0603]  (hidden comment: Resistor)
R42  value 0R  [R0603]  (hidden comment: Resistor)
R63  value 10K  [R0402]  (hidden comment: Resistor)
R67  value 100K  [R0603]  (hidden comment: Resistor)
R77  value 330R  [R0603]  (hidden comment: Resistor)
SB3  SB_ON  [SOLDER-BRIDGE_R0603-0R]  (value not drawn)
SB4  SB_ON  [SOLDER-BRIDGE_R0603-0R]  (value not drawn)
SB11  SB_ON  [SOLDER-BRIDGE_R0603-0R]  (value not drawn)
SB12  SB_ON  [SOLDER-BRIDGE_R0603-0R]  (value not drawn)
SB15  SB_ON  [SOLDER-BRIDGE_R0603-0R]  (value not drawn)
SB16  SB_ON  [SOLDER-BRIDGE_R0603-0R]  (value not drawn)
SB17  SB_ON  [SOLDER-BRIDGE_R0603-0R]  (value not drawn)
SB21  SB_ON  [SOLDER-BRIDGE_R0603-0R]  (value not drawn)
SB26  SB_ON  [SOLDER-BRIDGE_R0603-0R]  (value not drawn)
SB27  SB_ON  [SOLDER-BRIDGE_R0603-0R]  (value not drawn)
SB29  SB_ON  [SOLDER-BRIDGE_R0603-0R]  (value not drawn)
SB36  SB_ON  [SOLDER-BRIDGE_R0603-0R]  (value not drawn)
SB46  SB_ON  [SOLDER-BRIDGE_R0603-0R]  (value not drawn)
SB48  SB_ON  [SOLDER-BRIDGE_R0603-0R]  (value not drawn)
SB50  SB_ON  [SOLDER-BRIDGE_R0603-0R]  (value not drawn)
SB52  SB_ON  [SOLDER-BRIDGE_R0603-0R]  (value not drawn)
SB63  SB_ON  [SOLDER-BRIDGE_R0603-0R]  (value not drawn)
SB64  SB_ON  [SOLDER-BRIDGE_R0603-0R]  (value not drawn)
SB66  SB_ON  [SOLDER-BRIDGE_R0603-0R]  (value not drawn)
SB67  SB_ON  [SOLDER-BRIDGE_R0603-0R]  (value not drawn)
SB71  SB_ON  [SOLDER-BRIDGE_R0603-0R]  (value not drawn)
SB72  SB_ON  [SOLDER-BRIDGE_R0603-0R]  (value not drawn)
SB80  SB_ON  [SOLDER-BRIDGE_R0603-0R]  (value not drawn)
SB81  SB_ON  [SOLDER-BRIDGE_R0603-0R]  (value not drawn)
SB82  SB_ON  [SOLDER-BRIDGE_R0603-0R]  (value not drawn)
SB84  SB_ON  [SOLDER-BRIDGE_R0603-0R]  (value not drawn)
SB90  SB_ON  [SOLDER-BRIDGE_R0603-0R]  (value not drawn)
SB91  SB_ON  [SOLDER-BRIDGE_R0603-0R]  (value not drawn)
SB94  SB_ON  [SOLDER-BRIDGE_R0603-0R]  (value not drawn)
SB96  SB_ON  [SOLDER-BRIDGE_R0603-0R]  (value not drawn)
SB100  SB_ON  [SOLDER-BRIDGE_R0603-0R]  (value not drawn)
SB103  SB_ON  [SOLDER-BRIDGE_R0603-0R]  (value not drawn)
SB104  SB_ON  [SOLDER-BRIDGE_R0603-0R]  (value not drawn)
TP4  Test Point  [TP_SMD_1MM]  (value not drawn)  (no BOM)
U14  value STM32H745ZIT6U  [ICC_LQFP144_20X20_P050_SOCKET_YAMAICHI_IC149-144-145-B5_NM]  (hidden comment: STM32H7_LQFP144_SMPS)  (parts A,B of 3)
U20  value ESDALC6V1-1U2  [ESD_ST0201]  (hidden comment: ESD-TRANSIL)
U23  value ESDALC6V1-1U2  [ESD_ST0201]  (hidden comment: ESD-TRANSIL)
X2  value NX2016SA 25MHz  [CRY_NX2016SA_4P]  (hidden comment: XTAL_4_PINS)
X3  value NX3215SA 32.768KHz  [CRY_NX3215SA_2P]  (hidden comment: XTAL_2_PINS)

### Ports
ARD_D0_RX (bidir), ARD_D1_TX (bidir), BOOT0 (bidir), NRST (bidir), PA[0..15] (bidir), PB[0..15] (bidir), PC14 (bidir), PC15 (bidir), PC[0..15] (bidir), PD[0..15] (bidir), PE[0..15] (bidir), PF[6..11] (bidir), PF[14..15] (bidir), PG[6..14] (bidir), PH0 (bidir), PH1 (bidir), PH[0..1] (bidir), RMII_CRS_DV (bidir), RMII_MDC (bidir), RMII_MDIO (bidir), RMII_REF_CLK (bidir), RMII_RXD0 (bidir), RMII_RXD1 (bidir), RMII_TX_EN (bidir), RMII_TXD0 (bidir), RMII_TXD1 (bidir), STLK_MCO (bidir), SWCLK (bidir), SWDIO (bidir), SWO (bidir), T_JTDI (bidir), T_VCP_RX (bidir), T_VCP_TX (bidir), USART3_RX (bidir), USART3_TX (bidir), USB_FS_ID (bidir), USB_FS_N (bidir), USB_FS_OVCR, USB_FS_P (bidir), USB_FS_PWR_EN, USB_FS_VBUS (bidir)

### Nets
GND: B2.3 B2.4 C60.1 C66.1 C74.2 C76.2 C77.2 C78.2 R36.2 R38.2 R67.1 U20.2(GND) U23.2(GND) X2.2 X2.4
VDD: B1.1 B1.2 R37.2  [also labelled VDD_MCU]  [project net 3V3]
ARD_D0_RX: SB94.2 SB96.1 ; port ARD_D0_RX
ARD_D1_TX: SB11.1 SB15.2 ; port ARD_D1_TX
BOOT0: R36.1 U14.135(BOOT0) ; port BOOT0
NRST: B2.1 B2.2 C66.2 U14.27(NRST) U20.1(IO1) ; port NRST  [project net CPU_RST]
OSC32_IN: C77.1 R41.2 X3.2(X2)
OSC32_OUT: C78.1 R42.1 X3.1(X1)
OSC_IN: C76.1 SB3.2 X2.1
OSC_OUT: C74.1 SB4.2 X2.3
PA0: SB81.2 U14.37(PA0-WKUP0)
PA1: SB80.1 U14.38(PA1)
PA2: JP7.2(NO) U14.39(PA2)
PA3: U14.40(PA3)
PA4: U14.43(PA4)
PA5: U14.44(PA5)
PA6: U14.45(PA6)
PA7: SB52.1 U14.46(PA7)
PA8: TP4.1 U14.97(PA8)
PA9: SB21.1 U14.98(PA9)
PA10: SB29.1 U14.99(PA10)
PA11: SB26.1 U14.100(PA11)
PA12: SB27.1 U14.101(PA12)
PA13: U14.102(PA13) ; port SWDIO
PA14: U14.107(PA14) ; port SWCLK
PA15: U14.108(PA15) ; port T_JTDI
PB0: U14.49(PB0)
PB1: U14.50(PB1)
PB2: U14.51(PB2)
PB3: SB50.2 U14.130(PB3)
PB4: U14.131(PB4)
PB5: U14.132(PB5)
PB6: SB11.2 SB12.2 U14.133(PB6)
PB7: SB64.2 SB96.2 U14.134(PB7)
PB8: U14.136(PB8)
PB9: U14.137(PB9)
PB10: U14.66(PB10) ; port USART3_TX
PB11: U14.67(PB11) ; port USART3_RX
PB12: U14.72(PB12)
PB13: JP6.1(COMMON) U14.73(PB13)
PB14: U14.74(PB14)
PB15: U14.75(PB15)
PC0: U14.28(PC0)
PC1: SB84.2 U14.29(PC1)
PC2: U14.30(PC2-C)
PC3: U14.31(PC3-C)
PC4: SB63.2 U14.47(PC4)
PC5: SB48.2 U14.48(PC5)
PC6: U14.93(PC6)
PC7: U14.94(PC7)
PC8: U14.95(PC8)
PC9: U14.96(PC9)
PC10: U14.109(PC10)
PC11: U14.110(PC11)
PC12: U14.111(PC12)
PC13: SB82.2 U14.9(PC13-WKUP2)
PC14: SB66.1 ; port PC14
PC14-MCU: R41.1 SB66.2 U14.10(PC14-OSC32_IN)
PC15: SB67.1 ; port PC15
PC15-MCU: R42.2 SB67.2 U14.11(PC15-OSC32_OUT)
PD0: U14.112(PD0)
PD1: U14.113(PD1)
PD2: U14.114(PD2)
PD3: U14.115(PD3)
PD4: U14.116(PD4)
PD5: U14.117(PD5)
PD6: U14.120(PD6)
PD7: U14.121(PD7)
PD8: SB103.1
PD9: SB104.1
PD10: JP8.2(NO) U14.78(PD10)
PD11: U14.81(PD11)
PD12: U14.82(PD12)
PD13: U14.83(PD13)
PD14: U14.84(PD14)
PD15: U14.85(PD15)
PE0: U14.138(PE0)
PE1: U14.139(PE1)
PE2: U14.1(PE2)
PE3: U14.2(PE3)
PE4: U14.3(PE4)
PE5: U14.4(PE5)
PE6: U14.5(PE6)
PE7: U14.57(PE7)
PE8: U14.58(PE8)
PE9: U14.59(PE9)
PE10: U14.60(PE10)
PE11: U14.61(PE11)
PE12: U14.62(PE12)
PE13: U14.63(PE13)
PE14: U14.64(PE14)
PE15: U14.65(PE15)
PF6: U14.20(PF6)
PF7: U14.21(PF7)
PF8: U14.22(PF8)
PF9: U14.23(PF9)
PF10: SB91.1 U14.24(PF10)
PF11: U14.52(PF11)
PF14: U14.53(PF14)
PF15: U14.54(PF15)
PG6: U14.86(PG6)
PG7: SB100.2 U14.87(PG7)
PG8: U14.88(PG8)
PG9: U14.122(PG9)
PG10: U14.123(PG10)
PG11: SB36.2 U14.124(PG11)
PG12: U14.125(PG12)
PG13: SB46.2 U14.126(PG13)
PG14: U14.127(PG14)
PH0: SB71.2 ; port PH0
PH0-MCU: SB3.1 SB71.1 SB72.1 U14.25(PH0-OSC_IN)
PH1: SB90.2 ; port PH1
PH1-MCU: SB4.1 SB90.1 U14.26(PH1-OSC_OUT)
RMII_CRS_DV: SB52.2 ; port RMII_CRS_DV
RMII_MDC: SB84.1 ; port RMII_MDC
RMII_MDIO: JP7.1(COMMON) ; port RMII_MDIO
RMII_REF_CLK: SB80.2 ; port RMII_REF_CLK
RMII_RXD0: SB63.1 ; port RMII_RXD0
RMII_RXD1: SB48.1 ; port RMII_RXD1
RMII_TX_EN: SB36.1 ; port RMII_TX_EN
RMII_TXD0: SB46.1 ; port RMII_TXD0
RMII_TXD1: JP6.2(NO) ; port RMII_TXD1
STLK_MCO: SB72.2 ; port STLK_MCO
T_SWO: SB50.1 ; port SWO
T_VCP_RX: SB17.2 SB64.1 ; port T_VCP_RX
T_VCP_TX: SB12.1 SB16.2 ; port T_VCP_TX
USB_FS_ID: SB29.2 ; port USB_FS_ID
USB_FS_N: SB26.2 ; port USB_FS_N
USB_FS_OVCR: SB100.1 ; port USB_FS_OVCR
USB_FS_P: SB27.2 ; port USB_FS_P
USB_FS_PWR_EN: JP8.1(COMMON) SB91.2 ; port USB_FS_PWR_EN
USB_FS_VBUS: R63.1 ; port USB_FS_VBUS
WAKEUP_KEY: B1.3 B1.4 R67.2 R77.2 U23.1(IO1)
NetC60_2: C60.2 R77.1 SB81.1 SB82.1
NetR37_1: R37.1 R38.1 U14.142(PDR_ON)
NetR63_2: R63.2 SB21.2
NetSB15_1: SB15.1 SB16.1 SB103.2 U14.76(PD8)
NetSB17_1: SB17.1 SB94.1 SB104.2 U14.77(PD9)

### Buses and harness runs
bus PA[0..15] = port PA[0..15]
bus PB[0..15] = port PB[0..15]
bus PC[0..15] = port PC[0..15]
bus PD[0..15] = port PD[0..15]
bus PE[0..15] = port PE[0..15]
bus PF[6..11] = port PF[6..11]
bus PF[14..15] = port PF[14..15]
bus PG[6..14] = port PG[6..14]
bus PH[0..1] = port PH[0..1]

### Notes on the sheet
- MCU IO CLK and RST
- (near SB80) (fitted on H745)
- USR BUT
- USER BUTTON
- (near B1) USER
- (near SB52) (fitted on H745)
- (fitted on H745)
- (near SB50) USART1_TX
- (near SB50) USART1_RX
- (7)
- (2)
- (near SB52) USB SOF / MCO1
- SB should be place close to the MCU to avoid stub on CLK lines
- (near SB84) (fitted on H745)
- Place capacitor close to MCU pad
- RESET FUNCTION
- (near SB48) (fitted on H745)
- RESET
- Exlusivity table : (Function1) OR (Function 2)
- (near C66) Place capacitor close to MCU pad
- EXTERNAL HSE CLK
- (OPTIONAL : not fitted by default)
- I/O	                ARDUINO / ZIO	OTHER
  (2)	PA8	D6	                USB_SOF / MCO1
  (5)	PA2	A8	                RMII_MDIO
  (6)	PB13	D18	                RMII_TXD1
  (7)	PB3	D23	                SWO
  (14)	PD10	D64	                USB_FS_PWR_EN
  (15)	PB14	D65	                LED_RED
- (near X2) 25MHz
- USART3_TX
- USART3_RX
- (14)
- C77 and C78 value can change based on the STM32
- EXTERNAL LSE CLK
- (near SB36) (fitted on H745)
- (near X3) 32K
- (near SB91) (fitted on H7A3)
- (near SB46) (fitted on H745)
- Title:
- Project:
- Size:
- Revision:
- Variant:
- A4
- -
- Date:
- Reference:
- Sheet:
- of
- (in symbol MCD-01401, part A) MCU_IOs (A,B,C); MCU CLK & RST
- (in symbol MCD-01401, part B) MCU_IOs (D,E,F,G)

### Library data of the parts
B1 = MCD-00002: Non-Open Push-Button 0.1A 24V; Manufacturer_Part_Number: TD-0341; Manufacturer: WEALTHMETAL; Part_Type: Misc; Provided_By: SUBCO; Internal_Part_Number: MCD-00002; ComponentLink1Description: Datasheet; Status: Released; ComponentLink1URL: http://tunmcdsvn.tun.st.com/Component_Datasheet_Library/Trunk/Misc/Wealthmetal_Tact-Switch_TD0341; ECCN_US: n/a; ECCN_EU: n/a
B2 = MCD-00001: Non-Open Push-Button 0.1A 24V BLACK; Manufacturer_Part_Number: TD-0341; Manufacturer: WEALTHMETAL; Part_Type: Misc; Provided_By: SUBCO; Internal_Part_Number: MCD-00001; ComponentLink1Description: Datasheet; Status: Released; ComponentLink1URL: http://tunmcdsvn.tun.st.com/Component_Datasheet_Library/Trunk/Misc/Wealthmetal_Tact-Switch_TD0341; ECCN_US: n/a; ECCN_EU: n/a
C60 C66 = MCD-00237: Capacitor, MLCC, 100nF, 6V3, X5R, 10%, 0603, T=0,8mm; Manufacturer_Part_Number: CC0603KRX5R5BB104; Manufacturer: YAGEO; Provided_By: SUBCO; ECCN_US: EAR99; ECCN_EU: NEC; Internal_Part_Number: MCD-00237; ComponentLink1Description: Datasheet; Status: Released; Part_Type: Capacitor; Package: C0603; ComponentLink1URL: http://tunmcdsvn.tun.st.com/Component_Datasheet_Library/Trunk/Capacitors/Yageo_Multilayer_capacitor_X5R_series_100pF_to_100uF
C74 C76 = MCD-01374: Capacitor, MLCC, 5.6pF, 50V, NPO, 5%, 0402, T=0,5mm; Manufacturer_Part_Number: CC0402BRNPO9BN5R6; Manufacturer: YAGEO; Provided_By: SUBCO; Internal_Part_Number: MCD-01374; Status: Released; Part_Type: Capacitor; Package: C0402; ComponentLink1Description: Datasheet; ComponentLink1URL: http://tunmcdsvn.tun.st.com/Component_Datasheet_Library/Trunk/Capacitors/Yageo_Capacitor_NP0_16V-to-50V; ECCN_US: N/A; ECCN_EU: N/A
C77 C78 = MCD-01367: Capacitor,5.1pF,0.25pF,50V,NPO,0603; Manufacturer_Part_Number: CC0603CRNPO9BN5R1; Manufacturer: YAGEO; Provided_By: SUBCO; Internal_Part_Number: MCD-01367; Status: Released; Part_Type: Capacitor; Package: C0603; ComponentLink1Description: Datasheet; ComponentLink1URL: http://tunmcdsvn.tun.st.com/Component_Datasheet_Library/Trunk/Capacitors/Yageo_Capacitor_NP0_16V-to-50V; ECCN_US: N/A; ECCN_EU: N/A
HW3 HW14 HW15 = MCD-00043: SHUNT 2.54mm BLACK; Manufacturer_Part_Number: SNT-100-BK-G; Manufacturer: SAMTEC; Part_Type: Mechanical; Alternate_Manufacturer_Part_Number: 316102S111A; Alternate_Manufacturer: JIUBABA; Provided_By: SUBCO; Internal_Part_Number: MCD-00043; ComponentLink1Description: Datasheet; Status: Released; ComponentLink1URL: http://tunmcdsvn.tun.st.com/Component_Datasheet_Library/Trunk/Connectors/Samtec_Shunt_Jumper_SNT100; ECCN_US: n/a; ECCN_EU: n/a
HW9 = MCD-00634: Blue Hat for switch TD0341X-G01-BLU; Part_Type: Mechanical; Manufacturer_Part_Number: 988.16.09.3.00002_SH-517; Manufacturer: JIUBABA; Provided_By: SUBCO; Internal_Part_Number: MCD-00634; Status: Released; ComponentLink1Description: Datasheet; ComponentLink1URL: http://tunmcdsvn.tun.st.com/Component_Datasheet_Library/Trunk/Mechanical/Jiubaba_HAT_SH-517; ECCN_US: n/a; ECCN_EU: n/a
HW11 = MCD-00635: Black Hat for switch TD0341X-G01-BLA; Part_Type: Mechanical; Manufacturer_Part_Number: 988.16.09.3.00003_SH-517; Manufacturer: JIUBABA; Provided_By: SUBCO; Internal_Part_Number: MCD-00635; Status: Released; ComponentLink1Description: Datasheet; ComponentLink1URL: http://tunmcdsvn.tun.st.com/Component_Datasheet_Library/Trunk/Mechanical/Jiubaba_HAT_SH-517; ECCN_US: n/a; ECCN_EU: n/a
JP6-JP8 = MCD-00683: Header, 2x1, 2,54mm, VR, TH, Height 5.84mm/2.54mm - Shunt Fitted by default; Part_Type: Connector; Manufacturer_Part_Number: TSW-102-07-x-S; Manufacturer: SAMTEC; Alternate_Manufacturer_Part_Number: 313102S111116; Alternate_Manufacturer: LIANYI; Provided_By: SUBCO; Internal_Part_Number: MCD-00683; Status: Released; ComponentLink1Description: Datasheet; ComponentLink1URL: http://tunmcdsvn.tun.st.com/Component_Datasheet_Library/Trunk/Connectors/Samtec_TSW-HTSW-series; ECCN_US: n/a; ECCN_EU: n/a
R36-R38 = MCD-00220: Resistor,10K,0603,1%,1/10W; Manufacturer_Part_Number: RC0603FR-0710KL; Manufacturer: YAGEO; Provided_By: SUBCO; ECCN_US: EAR99; ECCN_EU: NEC; Internal_Part_Number: MCD-00220; Status: Released; Part_Type: Resistor; ComponentLink1Description: Datasheet; Package: R0603; ComponentLink1URL: http://tunmcdsvn.tun.st.com/Component_Datasheet_Library/Trunk/Resistors/Yageo_Resistor_RC0603-series
R41 R42 = MCD-00056: Resistor,0R,0603,5%,1/10W; Manufacturer_Part_Number: RC0603JR-070RL; Manufacturer: YAGEO; Provided_By: SUBCO; ECCN_US: EAR99; ECCN_EU: NEC; Internal_Part_Number: MCD-00056; ComponentLink1Description: Datasheet; Status: Released; Part_Type: Resistor; Package: R0603; ComponentLink1URL: http://tunmcdsvn.tun.st.com/Component_Datasheet_Library/Trunk/Resistors/Yageo_Resistor_RC0603-series
R63 = MCD-00053: as R25 on sheet Copy of Power_Board; Internal_Part_Number: MCD-00053; Status: Released; Part_Type: Resistor; Package: R0402; ComponentLink1Description: Datasheet; ComponentLink1URL: http://tunmcdsvn.tun.st.com/Component_Datasheet_Library/Trunk/Resistors/Yageo_Resistor_RC0402-series
R67 = MCD-00223: as R71 on sheet Copy of Connectors; Internal_Part_Number: MCD-00223; ComponentLink1Description: Datasheet; Status: Released; Part_Type: Resistor; Package: R0603; ComponentLink1URL: http://tunmcdsvn.tun.st.com/Component_Datasheet_Library/Trunk/Resistors/Yageo_Resistor_RC0603-series
R77 = MCD-00197: Resistor,330R,0603,1%,1/10W; Manufacturer_Part_Number: RC0603FR-07330RL; Manufacturer: YAGEO; BMS_Part_Number: 9129729; Provided_By: SUBCO; ECCN_US: EAR99; ECCN_EU: NEC; Internal_Part_Number: MCD-00197; Status: Released; Part_Type: Resistor; Package: R0603; ComponentLink1Description: Datasheet; ComponentLink1URL: http://tunmcdsvn.tun.st.com/Component_Datasheet_Library/Trunk/Resistors/Yageo_Resistor_RC0603-series
SB3 SB4 SB11 SB12 SB15-SB17 SB21 SB26 SB27 SB29 SB36 SB46 SB48 SB50 SB52 SB63 SB64 SB66 SB67 SB71 SB72 SB80-SB82 SB84 SB90 SB91 SB94 SB96 SB100 SB103 SB104 = MCD-00071: as SB54 on sheet Copy of Connectors; Internal_Part_Number: MCD-00071; Status: Released; ComponentLink1Description: Datasheet; Package: SB0603; ComponentLink1URL: http://tunmcdsvn.tun.st.com/Component_Datasheet_Library/Trunk/Resistors/Yageo_Resistor_RC0603-series; ECCN_US: n/a; ECCN_EU: n/a
TP4 = MCD-00074: Test Point 1mm; Part_Type: Mechanical; Internal_Part_Number: MCD-00074; Status: Released; Manufacturer_Part_Number: n/a; Manufacturer: n/a; ComponentLink1Description: Datasheet; ComponentLink1URL: http://na; Provided_By: n/a; ECCN_US: n/a; ECCN_EU: n/a
U14 = MCD-01401: STM32H745ZIT6U, LQFP144 package, 20x20, with socket footprint; Part_Type: IC; Manufacturer: STMICROELECTRONICS; BMS_Part_Number: 9175297 (cut 2.0); ECCN_US: 3A991A2; ECCN_EU: NEC; Provided_By: SUBCO with ST control; Internal_Part_Number: MCD-01401; Status: Released; Manufacturer_Part_Number: STM32H745ZIT6U; Package: LQFP144 20x20; ComponentLink1Description: Datasheet; ComponentLink1URL: http://tunmcdsvn.tun.st.com/Component_Datasheet_Library/Trunk/IC/STM_STM32L552ZET6QU
U20 U23 = MCD-00170: ESD protection 6V1; Part_Type: Diode; Manufacturer: STMICROELECTRONICS; BMS_Part_Number: 9151132; Provided_By: SUBCO with ST control; ECCN_US: EAR99; ECCN_EU: NEC; Internal_Part_Number: MCD-00170; Status: Released; Manufacturer_Part_Number: ESDALC6V1-1U2; ComponentLink1Description: Datasheet; ComponentLink1URL: http://tunmcdsvn.tun.st.com/Component_Datasheet_Library/Trunk/Diodes/STM_ESD_ESDALC6V1-1U2
X2 = MCD-01364: Crystal 25MHz, 6pF, +-20ppm, 80ohms max, SMD; Part_Type: Crystal_Osc; Manufacturer_Part_Number: NX2016SA 25MHz EXS00A-CS11321; Manufacturer: NDK; BMS_Part_Number: 9157044; Provided_By: SUBCO; ECCN_US: EAR99; ECCN_EU: NEC; Internal_Part_Number: MCD-01364; Status: Released; Package: NX2016SA; ComponentLink1Description: Datasheet; ComponentLink1URL: http://tunmcdsvn.tun.st.com/Component_Datasheet_Library/Trunk/Crystal_Osc/NDK_NX2016SA 25MHz EXS00A-CS11321 (EXS10B-28187); Order_Code_Digikey: 644-1367
X3 = MCD-00091: Crystal 32.768kHz, 6pF, +-20ppm, 50Kohms max, SMD; Manufacturer_Part_Number: NX3215SA 32.768KHz EXS00A-MU00525; Manufacturer: NDK; Part_Type: Crystal_Osc; BMS_Part_Number: 9157034; Provided_By: SUBCO; ECCN_US: EAR99; ECCN_EU: NEC; Internal_Part_Number: MCD-00091; ComponentLink1Description: Datasheet; Status: Released; ComponentLink1URL: http://tunmcdsvn.tun.st.com/Component_Datasheet_Library/Trunk/Crystal_Osc/NDK_Crystal-For-ST_NX3215SA 32.768KHz EXS00A-MU00525 (EXS10B-21238); Order_Code_Digikey: 644-1386